# Altium schematic sheet BMI088.SchDoc
size A; SheetNumber: 4; SheetTotal: 14
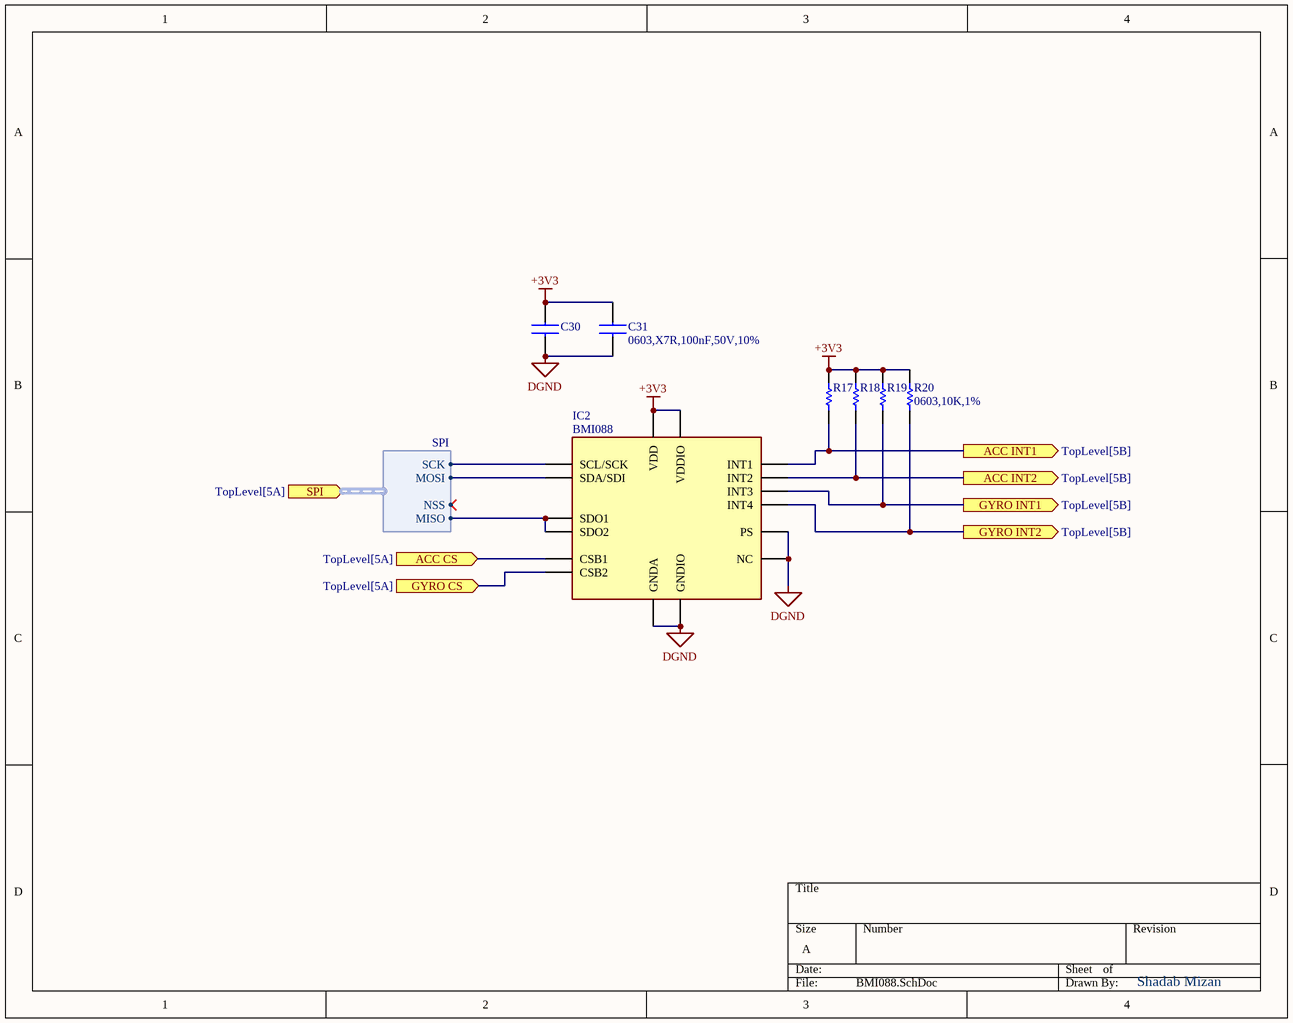
[diagram p0: BMI088.SchDoc]

## Parts
C30  0603,X7R,100nF,50V,10%  [CAPC1608X90N]  (value not drawn)
C31  0603,X7R,100nF,50V,10%  [CAPC1608X90N]
IC2  BMI088  [BMI088]
R17  0603,10K,1%  [RESC1608X90N]  (value not drawn)
R18  0603,10K,1%  [RESC1608X90N]  (value not drawn)
R19  0603,10K,1%  [RESC1608X90N]  (value not drawn)
R20  0603,10K,1%  [RESC1608X90N]

## Ports
ACC CS (in, see TopLevel[5A]), ACC INT1 (out, see TopLevel[5B]), ACC INT2 (out, see TopLevel[5B]), GYRO CS (in, see TopLevel[5A]), GYRO INT1 (out, see TopLevel[5B]), GYRO INT2 (out, see TopLevel[5B]), SPI (in, harness SPI, see TopLevel[5A])

## Harnesses
SPI: NSS, SCK, MISO, MOSI

## Nets
+3V3: C30.2 C31.2 IC2.3(VDD) IC2.11(VDDIO) R17.2 R18.2 R19.2 R20.2
DGND: C30.1 C31.1 IC2.2(NC) IC2.4(GNDA) IC2.6(GNDIO) IC2.7(PS)
ACC CS: IC2.14(CSB1) ; port ACC CS
ACC INT1: IC2.16(INT1) R17.1 ; port ACC INT1
ACC INT2: IC2.1(INT2) R18.1 ; port ACC INT2
GYRO CS: IC2.5(CSB2) ; port GYRO CS
GYRO INT1: IC2.12(INT3) R19.1 ; port GYRO INT1
GYRO INT2: IC2.13(INT4) R20.1 ; port GYRO INT2
NetIC2_8: IC2.8(SCL/SCK) ; port SPI.SCK
NetIC2_9: IC2.9(SDA/SDI) ; port SPI.MOSI
NetIC2_10: IC2.10(SDO2) IC2.15(SDO1) ; port SPI.MISO

## Notes on the sheet
- Shadab Mizan

## Library data of the parts
C30 C31 = CC0603KRX7R9BB104: 50V 100nF X7R ±10% 0603 Multilayer Ceramic Capacitors MLCC - SMD/SMT ROHS; LCSC Part #: C14663; Manu Part #: CC0603KRX7R9BB104
IC2 = BMI088: Inertial Measurement Unit IMU 6-Axis LGA; LCSC Part #: C194919; Manu Part #: BMI088
R17-R20 = 0603WAF1002T5E: 100mW Thick Film Resistor 75V ±100ppm/℃ ±1% 10kΩ 0603 Chip Resistor - Surface Mount ROHS; LCSC Part #: C25804; Manu Part #: 0603WAF1002T5E